# Altium project Servo-Board-v1.0.PrjPcb (part 8 of 19)

## Sheet Sec_Controller_Sheet2.SchDoc
size 420 x 297 mm; SheetNumber: 16; SheetTotal: 32
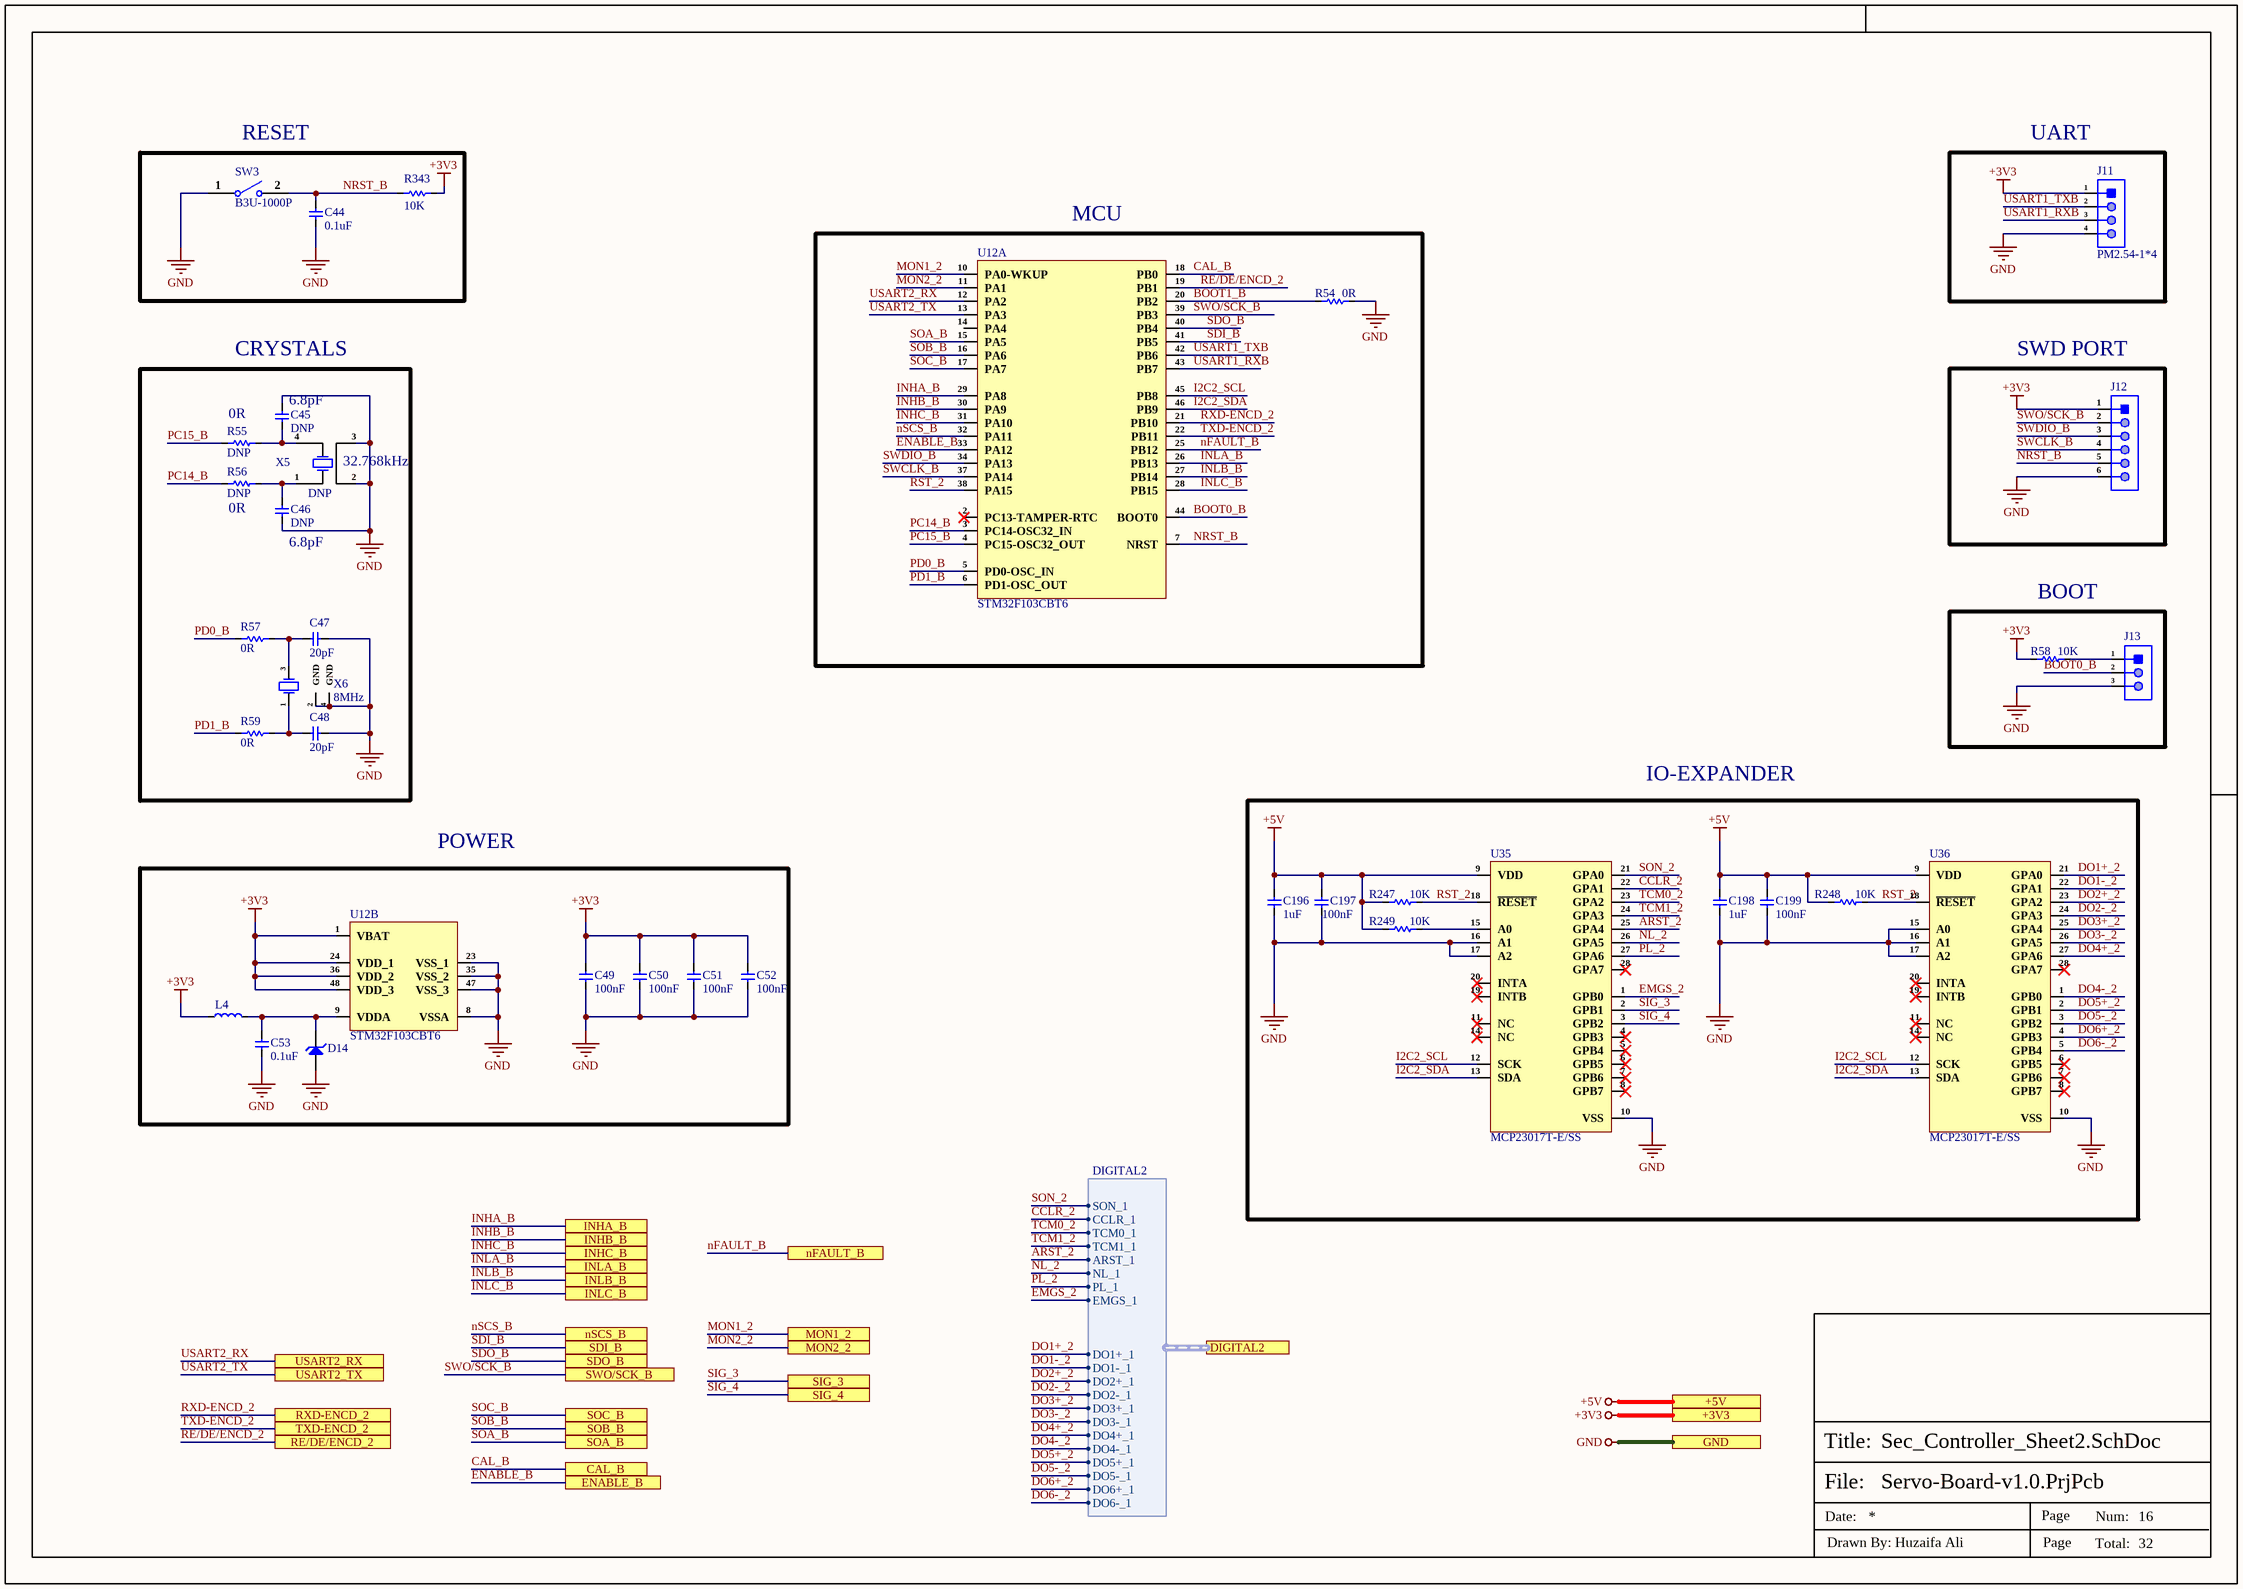
[diagram p15: Sec_Controller_Sheet2.SchDoc]

### Parts
C44  0.1uF  [Cap-0402]
C45  DNP  [Cap-0402]
C46  DNP  [Cap-0402]
C47  20pF  [Cap-0402]
C48  20pF  [Cap-0402]
C49  100nF  [cap-0402]
C50  100nF  [cap-0402]
C51  100nF  [cap-0402]
C52  100nF  [cap-0402]
C53  0.1uF  [Cap-0402]
C196  1uF  [Cap-0402]
C197  100nF  [cap-0402]
C198  1uF  [Cap-0402]
C199  100nF  [cap-0402]
D14  AZ3003-01G  [SOD-123]  (value not drawn)
J11  PM2.54-1*4  [HDR1X4 Female]
J12  X6511WV-06H-C60D30  [HDR1X6_]  (value not drawn)
J13  68000-103HLF  [HDR1X3_]  (value not drawn)
L4  BLM15AG601SN1D  [IND-0402]  (value not drawn)
R54  0R  [Res-0402]
R55  DNP  [Res-0603]
R56  DNP  [Res-0603]
R57  0R  [Res-0603]
R58  10K  [Res-0402]
R59  0R  [Res-0603]
R247  10K  [Res-0402]
R248  10K  [Res-0402]
R249  10K  [Res-0402]
R343  10K  [Res-0402]
SW3  B3U-1000P  [B3U-1000P]
U12  STM32F103CBT6  [48-LQFP (7x7)_]  (parts A,B of 2)
U35  MCP23017T-E/SS  [SSOP-28-208mil]
U36  MCP23017T-E/SS  [SSOP-28-208mil]
X5  DNP  [MC-306]
X6  8MHz  [5TJ480000XYLBC_]

### Blocks framed on the sheet
RESET: C44 R343 SW3
UART: J11
MCU: R54 U12
CRYSTALS: C45-C48 R55-R57 R59 X5 X6
SWD PORT: J12
BOOT: J13 R58
IO-EXPANDER: C196-C199 R247-R249 U35 U36
POWER: C49-C53 D14 L4 U12

### Ports
+3V3 (see Servo2[2A], CAN_Sheet[5D], Connector_Sheet[5D], Controller_Sheet[5D], Encoder_Sheet1[5D], Encoder_Sheet2[5D], Encoder_Sheet3[5D], Encoder_Sheet4[5D], EtherCAT_Sheet[5D], Motor_Driver_Sheet1[5D], Motor_Driver_Sheet2[5D], Motor_Driver_Sheet3[5D], Motor_Driver_Sheet4[5D], Power_Sheet[5D], RJ45_Sheet[5D], RS485_RS232_Sheet[3D], Sec_Controller_Sheet1[5D], Sec_Controller_Sheet3[5D], Sec_Controller_Sheet4[5D]), +5V, CAL_B (see Servo2[2B], Motor_Driver_Sheet2[3D]), DIGITAL2 (harness DIGITAL2, see Servo2[2B], DIO_2[4D]), ENABLE_B (see Servo2[2B], Motor_Driver_Sheet2[3D]), GND (see Servo2[2B], CAN_Sheet[5D], Connector_Sheet[5D], Controller_Sheet[5D], DIO_1[5D], DIO_2[5D], DIO_3[5D], DIO_4[5D], Encoder_Sheet1[5D], Encoder_Sheet2[5D], Encoder_Sheet3[5D], Encoder_Sheet4[5D], EtherCAT_Sheet[5D], MOSFET_Driver_Sheet1[5D], MOSFET_Driver_Sheet2[5D], MOSFET_Driver_Sheet3[5D], MOSFET_Driver_Sheet4[5D], Motor_Driver_Sheet1[5D], Motor_Driver_Sheet2[5D], Motor_Driver_Sheet3[5D], Motor_Driver_Sheet4[5D], Power_Sheet[5D], RJ45_Sheet[5D], RS485_RS232_Sheet[3D], Sec_Controller_Sheet1[5D], Sec_Controller_Sheet3[5D], Sec_Controller_Sheet4[5D]), INHA_B (see Servo2[2B], Motor_Driver_Sheet2[3D]), INHB_B (see Servo2[2B], Motor_Driver_Sheet2[3D]), INHC_B (see Servo2[2B], Motor_Driver_Sheet2[3D]), INLA_B (see Servo2[2B], Motor_Driver_Sheet2[3D]), INLB_B (see Servo2[2B], Motor_Driver_Sheet2[3D]), INLC_B (see Servo2[2B], Motor_Driver_Sheet2[3D]), MON1_2 (see Servo2[2B], DIO_2[3D]), MON2_2 (see Servo2[2B], DIO_2[3D]), nFAULT_B (see Servo2[2B], Motor_Driver_Sheet2[3D]), nSCS_B (see Servo2[2B], Motor_Driver_Sheet2[3D]), RE/DE/ENCD_2 (see Servo2[2B], Encoder_Sheet2[3D]), RXD-ENCD_2 (see Servo2[2B], Encoder_Sheet2[3D]), SDI_B (see Servo2[2B], Motor_Driver_Sheet2[3D]), SDO_B (see Servo2[2B], Motor_Driver_Sheet2[3D]), SIG_3 (see Servo2[2B], DIO_2[2D]), SIG_4 (see Servo2[2B], DIO_2[2D]), SOA_B (see Servo2[2B], Motor_Driver_Sheet2[3D]), SOB_B (see Servo2[2B], Motor_Driver_Sheet2[3D]), SOC_B (see Servo2[2B], Motor_Driver_Sheet2[3D]), SWO/SCK_B (see Servo2[2B], Motor_Driver_Sheet2[3D]), TXD-ENCD_2 (see Servo2[2B], Encoder_Sheet2[3D]), USART2_RX (see Servo2[2B], Controller_Sheet[2D], Servo2[1B]), USART2_TX (see Servo2[2B], Controller_Sheet[2D], Servo2[1B])

### Harnesses
DIGITAL2: SON_1, TCM0_1, CCLR_1, TCM1_1, ARST_1, NL_1, PL_1, EMGS_1, DO1+_1, DO1-_1, DO2+_1, DO2-_1, DO3+_1, DO3-_1, DO4+_1, DO4-_1, DO5+_1, DO5-_1, DO6+_1, DO6-_1

### Nets
+3V3: C49.2 C50.2 C51.2 C52.2 J11.1 J12.1 L4.1 R58.2 R343.2 U12.1(VBAT) U12.24(VDD_1) U12.36(VDD_2) U12.48(VDD_3) ; port +3V3
+5V: C196.2 C197.2 C198.2 C199.2 R247.2 R248.2 R249.2 U35.9(VDD) U36.9(VDD) ; port +5V
GND: C44.1 C45.2 C46.1 C47.2 C48.2 C49.1 C50.1 C51.1 C52.1 C53.1 C196.1 C197.1 C198.1 C199.1 D14.1(A) J11.4 J12.6 J13.3 R54.2 SW3.1 U12.8(VSSA) U12.23(VSS_1) U12.35(VSS_2) U12.47(VSS_3) U35.10(VSS) U35.16(A1) U35.17(A2) U36.10(VSS) U36.15(A0) U36.16(A1) U36.17(A2) X5.2 X5.3 X6.2(GND) X6.4(GND) ; port GND
ARST_2: U35.25(GPA4) ; port DIGITAL2.ARST_1
BOOT0_B: J13.2 U12.44(BOOT0)
BOOT1_B: R54.1 U12.20(PB2)
CAL_B: U12.18(PB0) ; port CAL_B
CCLR_2: U35.22(GPA1) ; port DIGITAL2.CCLR_1
DO1+_2: U36.21(GPA0) ; port DIGITAL2.DO1+_1
DO1-_2: U36.22(GPA1) ; port DIGITAL2.DO1-_1
DO2+_2: U36.23(GPA2) ; port DIGITAL2.DO2+_1
DO2-_2: U36.24(GPA3) ; port DIGITAL2.DO2-_1
DO3+_2: U36.25(GPA4) ; port DIGITAL2.DO3+_1
DO3-_2: U36.26(GPA5) ; port DIGITAL2.DO3-_1
DO4+_2: U36.27(GPA6) ; port DIGITAL2.DO4+_1
DO4-_2: U36.1(GPB0) ; port DIGITAL2.DO4-_1
DO5+_2: U36.2(GPB1) ; port DIGITAL2.DO5+_1
DO5-_2: U36.3(GPB2) ; port DIGITAL2.DO5-_1
DO6+_2: U36.4(GPB3) ; port DIGITAL2.DO6+_1
DO6-_2: U36.5(GPB4) ; port DIGITAL2.DO6-_1
EMGS_2: U35.1(GPB0) ; port DIGITAL2.EMGS_1
ENABLE_B: U12.33(PA12) ; port ENABLE_B
I2C2_SCL: U12.45(PB8) U35.12(SCK) U36.12(SCK)
I2C2_SDA: U12.46(PB9) U35.13(SDA) U36.13(SDA)
INHA_B: U12.29(PA8) ; port INHA_B
INHB_B: U12.30(PA9) ; port INHB_B
INHC_B: U12.31(PA10) ; port INHC_B
INLA_B: U12.26(PB13) ; port INLA_B
INLB_B: U12.27(PB14) ; port INLB_B
INLC_B: U12.28(PB15) ; port INLC_B
MON1_2: U12.10(PA0-WKUP) ; port MON1_2
MON2_2: U12.11(PA1) ; port MON2_2
nFAULT_B: U12.25(PB12) ; port nFAULT_B
NL_2: U35.26(GPA5) ; port DIGITAL2.NL_1
NRST_B: C44.2 J12.5 R343.1 SW3.2 U12.7(NRST)
nSCS_B: U12.32(PA11) ; port nSCS_B
PC14_B: R56.2 U12.3(PC14-OSC32_IN)
PC15_B: R55.2 U12.4(PC15-OSC32_OUT)
PD0_B: R57.2 U12.5(PD0-OSC_IN)
PD1_B: R59.2 U12.6(PD1-OSC_OUT)
PL_2: U35.27(GPA6) ; port DIGITAL2.PL_1
RE/DE/ENCD_2: U12.19(PB1) ; port RE/DE/ENCD_2
RST_2: R247.1 R248.1 U12.38(PA15) U35.18(~{RESET}) U36.18(~{RESET})
RXD-ENCD_2: U12.21(PB10) ; port RXD-ENCD_2
SDI_B: U12.41(PB5) ; port SDI_B
SDO_B: U12.40(PB4) ; port SDO_B
SIG_3: U35.2(GPB1) ; port SIG_3
SIG_4: U35.3(GPB2) ; port SIG_4
SOA_B: U12.15(PA5) ; port SOA_B
SOB_B: U12.16(PA6) ; port SOB_B
SOC_B: U12.17(PA7) ; port SOC_B
SON_2: U35.21(GPA0) ; port DIGITAL2.SON_1
SWCLK_B: J12.4 U12.37(PA14)
SWDIO_B: J12.3 U12.34(PA13)
SWO/SCK_B: J12.2 U12.39(PB3) ; port SWO/SCK_B
TCM0_2: U35.23(GPA2) ; port DIGITAL2.TCM0_1
TCM1_2: U35.24(GPA3) ; port DIGITAL2.TCM1_1
TXD-ENCD_2: U12.22(PB11) ; port TXD-ENCD_2
USART1_RXB: J11.3 U12.43(PB7)
USART1_TXB: J11.2 U12.42(PB6)
USART2_RX: U12.12(PA2) ; port USART2_RX
USART2_TX: U12.13(PA3) ; port USART2_TX
NetC45_1: C45.1 R55.1 X5.4(OSC2)
NetC46_2: C46.2 R56.1 X5.1(OSC1)
NetC47_1: C47.1 R57.1 X6.3(OSC2)
NetC48_1: C48.1 R59.1 X6.1(OSC1)
NetC53_2: C53.2 D14.2(K) L4.2 U12.9(VDDA)
NetJ13_1: J13.1 R58.1
NetR249_1: R249.1 U35.15(A0)

Not connected (* = marked no-connect by the designer): U12 2(PC13-TAMPER-RTC)* 14(PA4); U35 4(GPB3)* 5(GPB4)* 6(GPB5)* 7(GPB6)* 8(GPB7)* 11(NC)* 14(NC)* 19(INTB)* 20(INTA)* 28(GPA7)*; U36 6(GPB5)* 7(GPB6)* 8(GPB7)* 11(NC)* 14(NC)* 19(INTB)* 20(INTA)* 28(GPA7)*

### Notes on the sheet
- (near R55) 0R
- (near C45) 6.8pF
- (near R56) 0R
- (near X5) 32.768kHz
- (near C46) 6.8pF
- File:
- Title:
- Date:
- Page
- Num:
- Total:
- Drawn By: Huzaifa Ali

### Library data of the parts
C44 C53 = CC0402JRX7R7BB104: CAP CER 0.1UF 16V X7R 0402; Manufacturer: Yageo; Material: 4241ConductorMaterial; Value: 100nF; Tolerance: 5%; Item Type: Capacitor; Supplier: Digikey; Supplier Part Number: 311-1676-1-ND; Manufacturer Part Number: CC0402JRX7R7BB104; RoHS: Yes; Category: Ceramic Capacitors; Stock: 1659111; Pricing: 1=0.1, 10=0.046, 50=0.0262, 100=0.0203, 500=0.01528, 1000=0.012, 2500=0.01091, 5000=0.01004 (USD); Mounting Technology: Surface Mount; Case/Package: 0402; Case Code (Metric): 1005; Case Code (Imperial): 0402; Min Operating Temperature: -55°C; Max Operating Temperature: 125°C; Dielectric: X7R; Packaging: Tape and Reel; Package Quantity: 10000; Voltage Rating (DC): 16V; Voltage Rating: 16V; Series: CC; Construction: Flat; Length: 0.039inch; Width: 0.02inch; Height: 0.5mm; Thickness: 0.022inch; Lead Free: Lead Free; Halogen Free: Halogen Free; RoHS Compliant: Yes; ComponentLink1URL: https://datasheet.ciiva.com/13210/upy-gphc-x7r-6-3v-to-50v-8-12304-13210152.pdf?src-supplier=Mouser; ComponentLink1Description: https://datasheet.ciiva.com/13210/upy-gphc-x7r-6-3v-to-50v-8-12304-13210152.pdf?src-supplier=Mouser; LCSC Part Number: C541464
C45 C46 = CC0402CRNPO9BN6R8: CAP CER 6.8PF 50V C0G/NPO 0402; Manufacturer: Yageo; Dielectric: C0G; Tolerance: 2%; Insulation Resistance: 10GR; Item Type: Capacitor; Supplier: Future Electronics; Supplier Part Number: 3247368; Manufacturer Part Number: CC0402CRNPO9BN6R8; RoHS: Yes; Category: Ceramic Capacitors; Stock: 200000; Pricing: 10000=0.0024, 40000=0.0022, 150000=0.0021, 400000=0.002, 1000000=0.0019 (USD); Mounting Technology: Surface Mount; Case/Package: 0402; Case Code (Imperial): 0402; Case Code (Metric): 1005; Weight: 2.3E-05oz; Min Operating Temperature: -55°C; Max Operating Temperature: 125°C; Value: 6.8pF; Packaging: Tape and Reel; Voltage Rating: 50V; Voltage Rating (DC): 50V; Termination: SMD/SMT; Series: CC; Construction: Flat; Length: 1mm; Width: 0.5mm; Height: 0.5mm; Depth: 0.5mm; Radiation Hardening: No; RoHS Compliant: Yes; ComponentLink1URL: https://datasheet.ciiva.com/11587/upy-gp-np0-16v-to-50v-8-11587182.pdf?src-supplier=Avnet; ComponentLink1Description: https://datasheet.ciiva.com/11587/upy-gp-np0-16v-to-50v-8-11587182.pdf?src-supplier=Avnet; LCSC Part Number: C189470
C47 C48 = CC0402JRNPO9BN200: CAP CER 20PF 50V C0G/NPO 0402; Manufacturer: Yageo; Item Type: Capacitor; Temperature Coefficient: 30ppm/°C; Supplier: Avnet; LCSC Part Number: C107000; Manufacturer Part Number: CC0402JRNPO9BN200; RoHS: Yes; Stock: 20000; Pricing: 10000=0.00221 (USD); Halogen Free: 5694HalogenFree; ComponentLink1URL: https://datasheet.ciiva.com/176/mlccorderingcode-176360.pdf?src-supplier=Digikey; ComponentLink1Description: https://datasheet.ciiva.com/176/mlccorderingcode-176360.pdf?src-supplier=Digikey; ComponentLink2URL: https://datasheet.ciiva.com/176/mlccorderingcode-176361.pdf?src-supplier=Digikey; ComponentLink2Description: https://datasheet.ciiva.com/176/mlccorderingcode-176361.pdf?src-supplier=Digikey; ComponentLink3URL: https://datasheet.ciiva.com/176/mlccorderingcode-176362.pdf?src-supplier=Digikey; ComponentLink3Description: https://datasheet.ciiva.com/176/mlccorderingcode-176362.pdf?src-supplier=Digikey; ComponentLink4URL: https://datasheet.ciiva.com/7656/1132289-7656614.pdf?src-supplier=Element14; ComponentLink4Description: https://datasheet.ciiva.com/7656/1132289-7656614.pdf?src-supplier=Element14; ComponentLink5URL: https://datasheet.ciiva.com/5427/upy-gp-np0-16v-to-50v-8-3714-5427769.pdf?src-supplier=Mouser; ComponentLink5Description: https://datasheet.ciiva.com/5427/upy-gp-np0-16v-to-50v-8-3714-5427769.pdf?src-supplier=Mouser
C49-C52 C197 C199 = C1005X7R1H104KT000F: CAP CER 0.1UF 50V X7R 0402; Manufacturer: TDK; Tolerance: 10%; Voltage: 25V; Item Type: Capacitor; Supplier 1: Avnet; Manufacturer Part Number: C1005X7R1H104KT000F; RoHS: No; Category: Ceramic Capacitors; Dielectric: X7R; Supplier Part Number 1: C1005X7R1H104KT000F; LCSC Part Number: C361198; ComponentLink1Description: LCSC; ComponentLink1URL: https://www.lcsc.com/product-detail/Multilayer-Ceramic-Capacitors-MLCC-SMD-SMT_TDK-C1005X7R1H104KT000F_C361198.html
C196 C198 = CC0402KRX5R6BB105: CAP CER 1UF 10V X5R 0402; Manufacturer: Yageo; Tolerance: 10%; Dissipation Factor: 15%; Item Type: Capacitor; Supplier 1: Mouser; Manufacturer Part Number: CC0402KRX5R6BB105; RoHS: Yes; Category: Ceramic Capacitors; Stock 1: 6711367; Pricing 1: 1=0.11000, 10=0.05500, 50=0.05500, 100=0.03300, 500=0.02700, 1000=0.02200, 2500=0.02100, 10000=0.01800 (USD); Mount: Surface Mount; Case/Package: 0402; Number of Pins: 2; Case Code (Metric): 1005; Case Code (Imperial): 0402; Min Operating Temperature: -55°C; Max Operating Temperature: 85°C; Capacitance: 1uF; Dielectric: X5R; Package Quantity: 1; Voltage Rating: 10V; Packaging: Tape and Reel; Voltage Rating (DC): 10V; Termination: SMD/SMT; Resistor Type: Ceramic; Series: CC; Construction: Flat; Length: 1mm; Width: 0.02inch; Height: 0.5mm; Thickness: 0.022inch; Depth: 0.5mm; Radiation Hardening: No; REACH SVHC: No SVHC; Lead Free: Lead Free; Halogen Free: Halogen Free; RoHS Compliant: Yes; ComponentLink1URL: https://datasheet.ciiva.com/176/upy-gphc-x5r-4v-to-50v-12-176704.pdf?src-supplier=Digi-Key; ComponentLink1Description: https://datasheet.ciiva.com/176/upy-gphc-x5r-4v-to-50v-12-176704.pdf?src-supplier=Digi-Key; ComponentLink2URL: https://datasheet.ciiva.com/176/mlccorderingcode-176705.pdf?src-supplier=Digi-Key; ComponentLink2Description: https://datasheet.ciiva.com/176/mlccorderingcode-176705.pdf?src-supplier=Digi-Key; ComponentLink3URL: https://datasheet.ciiva.com/176/mlccorderingcode-176706.pdf?src-supplier=Digi-Key; ComponentLink3Description: https://datasheet.ciiva.com/176/mlccorderingcode-176706.pdf?src-supplier=Digi-Key; Supplier Part Number 1: 603-CC402KRX5R6BB105; LCSC Part Number: C106254
D14 = AZ3003-01G: TVS SURGE PROTECTOR 1-CH 3.3V; Manufacturer: Amazing; Item Type: Diode; Manufacturer Part Number: AZ3003-01G; Package: SOD-123; LCSC Part Number: -; ComponentLink1Description: Digikey; ComponentLink1URL: https://www.digikey.com/en/products/detail/amazing/AZ3003-01G/16615352?s=N4IgTCBcDaIIIC0DMAGFSC0KCMBxEAugL5A
J11 = PM2.54-1*4: 2mm 2.54mm Plugin 2.5A -40℃~+105℃ Straight 1x4P Top 8.5mm 4 Square Hole Plugin,P=2.54mm Female Headers ROHS; Manufacturer: ZHOURI; Manufacturer Part Number: PM2.54-1*4; Package: Plugin,P=2.54mm; LCSC Part Number: C5116530; Item Type: Female Header; ComponentLink1Description: LCSC; ComponentLink1URL: https://www.lcsc.com/product-detail/span-style-background-color-ff0-Female-span-Headers_ZHOURI-PM2-54-1-4_C5116530.html
J12 = X6511WV-06H-C60D30: Gold 250V 3A Straight Square Pins 2.5mm 6P 260℃ 6mm -40℃~+105℃ 3mm 2.54mm Plugin Black Brass 1x6P Plugin,P=2.54mm Pin Headers ROHS; Manufacturer: XKB; Item Type: Male Header; Manufacturer Part Number: X6511WV-06H-C60D30; Package: Plugin,P=2.54mm; LCSC Part Number: C706878; ComponentLink1Description: LCSC; ComponentLink1URL: https://www.lcsc.com/product-detail/Pin-Headers_XKB-Connectivity-X6511WV-06H-C60D30_C706878.html
J13 = 68000-103HLF: CONN HEADER VERT 3POS 2.54MM; Item Type: Male Header; Number of Positions: 3; Current Rating: 3A; Insulation Resistance: 5GR; Voltage Rating: 1.5kV; Contact Post Length: 2.41mm; LCSC Part Number: C168677; ComponentLink1Description: LCSC; Supplier: Avnet; Supplier Part Number: 88K1775; RoHS: No; Category: Headers and Wire Housings; Stock: 2805; Pricing: 1=0.395, 10=0.31, 25=0.29, 50=0.27, 100=0.25 (USD); Contact Plating: Gold,GXT; Contact Material: Bronze; Housing Material: Thermoplastic; Housing Color: Black; Min Operating Temperature: -65°C; Max Operating Temperature: 125°C; Number of Rows: 1; Termination: Through Hole; Packaging: Bulk; Number of Contacts: 3; Contact Gender: Male; Orientation: Straight; Max Voltage Rating (AC): 1.5kV; Package Quantity: 100; Series: 68000; Length: 7.62mm; Pitch: 2.54mm; Contact Mating Length: 5.84mm; Depth: 2.41mm; Radiation Hardening: No; Flammability Rating: UL94 V-0; Reach SVHC Compliant: No; ComponentLink2URL: https://datasheet.ciiva.com/46392/1914865-46392021.pdf?src-supplier=Element14; ComponentLink2Description: https://datasheet.ciiva.com/46392/1914865-46392021.pdf?src-supplier=Element14
L4 = BLM15AG601SN1D: FERRITE BEAD 600 OHM 0402 1LN; Manufacturer: Murata; Material: Steel,Ferrite; Impedance: 600R; Tolerance: 25%; Max DC Current: 300mA; DC Resistance (DCR): 520mR; Test Frequency: 100MHz; Number of Lines: 1; Shielding: Unshielded; DC Resistance-Max: 600mR; Supplier 1: Digi-Key; Manufacturer Part Number: BLM15AG601SN1D; RoHS: Yes; Category: Inductors; Stock 1: 4108655; Pricing 1: 1=0.10000, 10=0.06500, 25=0.05760, 50=0.05240, 100=0.04710, 250=0.03456, 500=0.02514, 1000=0.02461, 5000=0.01676 (USD); Case/Package: 0402; Number of Pins: 2; Core Material: Ferrite; Case Code (Metric): 1005; Case Code (Imperial): 0402; Min Operating Temperature: -55°C; Max Operating Temperature: 125°C; Package Quantity: 10000; Packaging: Tape and Reel; Current Rating: 300mA; Max Current Rating: 300mA; Termination: SMD/SMT; DC Current: 300mA; Frequency: 100MHz; Number of Circuits: 1; Series: BLM15AG_SN; Length: 1mm; Width: 0.5mm; Height: 0.5mm; Depth: 0.55mm; Radiation Hardening: No; REACH SVHC: No SVHC; Military Standard: Not; Lead Free: Lead Free; RoHS Compliant: Yes; ComponentLink1URL: https://datasheet.ciiva.com/11799/0900766b811b5866-11799226.pdf?src-supplier=RSComponents; ComponentLink1Description: https://datasheet.ciiva.com/11799/0900766b811b5866-11799226.pdf?src-supplier=RSComponents; ComponentLink2URL: https://datasheet.ciiva.com/41449/001172163-da-01-en-drossel-0402-600r-1-0x0-5mm-10000st-41449450.pdf?src-supplier=Conrad; ComponentLink2Description: https://datasheet.ciiva.com/41449/001172163-da-01-en-drossel-0402-600r-1-0x0-5mm-10000st-41449450.pdf?src-supplier=Conrad; ComponentLink3URL: https://datasheet.ciiva.com/29347/442210-da-01-en-chip-drossel-0402-600r-300ma-1-0x0-5mm-29347879.pdf?src-supplier=Conrad; ComponentLink3Description: https://datasheet.ciiva.com/29347/442210-da-01-en-chip-drossel-0402-600r-300ma-1-0x0-5mm-29347879.pdf?src-supplier=Conrad; ComponentLink4URL: https://datasheet.ciiva.com/1466/5144-1466744.pdf?src-supplier=Element14; ComponentLink4Description: https://datasheet.ciiva.com/1466/5144-1466744.pdf?src-supplier=Element14; ComponentLink5URL: https://datasheet.ciiva.com/1466/5144-1466745.pdf?src-supplier=Element14; ComponentLink5Description: https://datasheet.ciiva.com/1466/5144-1466745.pdf?src-supplier=Element14; ComponentLink6URL: https://datasheet.ciiva.com/14122/blm-series-eng-tds-14122894.pdf?src-supplier=Distrelec; ComponentLink6Description: https://datasheet.ciiva.com/14122/blm-series-eng-tds-14122894.pdf?src-supplier=Distrelec; ComponentLink7URL: https://datasheet.ciiva.com/6212/l0110s0100blm15ag-sn-6212519.pdf?src-supplier=Digi-Key; ComponentLink7Description: https://datasheet.ciiva.com/6212/l0110s0100blm15ag-sn-6212519.pdf?src-supplier=Digi-Key; ComponentLink8URL: https://datasheet.ciiva.com/6212/l0110s0100blm15ag-sn-6212565.pdf?src-supplier=Digi-Key; ComponentLink8Description: https://datasheet.ciiva.com/6212/l0110s0100blm15ag-sn-6212565.pdf?src-supplier=Digi-Key; ComponentLink9URL: https://datasheet.ciiva.com/6212/l0110s0100blm15ag-sn-6212520.pdf?src-supplier=Digi-Key; ComponentLink9Description: https://datasheet.ciiva.com/6212/l0110s0100blm15ag-sn-6212520.pdf?src-supplier=Digi-Key; ComponentLink10URL: https://datasheet.ciiva.com/8084/l0110s0100blm15ag-sn-8084271.pdf?src-supplier=Avnet; ComponentLink10Description: https://datasheet.ciiva.com/8084/l0110s0100blm15ag-sn-8084271.pdf?src-supplier=Avnet; ComponentLink11URL: https://datasheet.ciiva.com/8510/l0110s0100blm15ag-sn-8510909.pdf?src-supplier=Avnet; ComponentLink11Description: https://datasheet.ciiva.com/8510/l0110s0100blm15ag-sn-8510909.pdf?src-supplier=Avnet; Supplier Part Number 1: 490-1006-1-ND; LCSC Part Number: C76884; Item Type: Ferrite Bead
R54 = RC0402FR-070RL: RES 0 OHM JUMPER 1/16W 0402; Manufacturer: Yageo; Item Type: Resistors; Tolerance: 1%; Power Rating: 62.5mW; Voltage Rating: 50V; Temperature Coefficient: 200ppm/°C; Max Power Dissipation: 63mW; Supplier 1: Mouser; Manufacturer Part Number: RC0402FR-070RL; RoHS: Yes; Stock 1: 8556842; Pricing 1: 1=0.10000, 10=0.01400, 50=0.01400, 100=0.00600, 1000=0.00300, 5000=0.00200, 10000=0.00100 (USD); Mount: Surface Mount; Case/Package: 0402; Contact Plating: Tin,Matte; Case Code (Imperial): 0402; Case Code (Metric): 1005; Size Code: 0402; Min Operating Temperature: -55°C; Max Operating Temperature: 155°C; Resistance: 0R; Resistor Type: Thick Film; Packaging: Tape and Reel; Termination: SMD/SMT; Features: Moisture Resistant; Series: RC; Number of Terminations: 2; Length: 1mm; Width: 0.5mm; Height: 0.35mm; Radiation Hardening: No; Lead Free: Lead Free; RoHS Compliant: Yes; ComponentLink1URL: https://datasheet.ciiva.com/8896/pyu-rc0402-51-rohs-l-6-8896149.pdf?src-supplier=Avnet; ComponentLink1Description: https://datasheet.ciiva.com/8896/pyu-rc0402-51-rohs-l-6-8896149.pdf?src-supplier=Avnet; ComponentLink2URL: https://datasheet.ciiva.com/16790/pyu-rc0402-51-rohs-l-6-r-16790444.pdf?src-supplier=Future+Electronics; ComponentLink2Description: https://datasheet.ciiva.com/16790/pyu-rc0402-51-rohs-l-6-r-16790444.pdf?src-supplier=Future+Electronics; Supplier Part Number 1: 603-RC0402FR-070RL; LCSC Part Number: C106231
R55-R57 R59 = RC0603JR-070RL: RES 0 OHM JUMPER 1/10W 0603; Manufacturer: Yageo; Resistance: 0mR; Tolerance: 1%; Power Rating: 100mW; Voltage Rating (DC): 50V; Temperature Coefficient: 200ppm/°C; Resistance Tolerance: 5%; Item Type: Resistor; Supplier 1: Digi-Key; Manufacturer Part Number: RC0603JR-070RL; RoHS: Yes; Category: Chip SMD Resistors; Stock 1: 18081776; Pricing 1: 1=0.10000, 10=0.01700, 25=0.01240, 50=0.00960, 100=0.00700, 250=0.00536, 500=0.00430, 1000=0.00316 (USD); Case/Package: 0603; Number of Pins: 2; Contact Plating: Tin,Matte; Case Code (Imperial): 0603; Case Code (Metric): 1608; Size Code: 0603; Min Operating Temperature: -55°C; Max Operating Temperature: 155°C; Resistor Type: Thick Film; Packaging: Tape and Reel; Termination: SMD/SMT; Series: RC; Technology: THICK FILM; Package Quantity: 5000; Voltage Rating: 50V; Features: Moisture Resistant; Max Power Dissipation: 100mW; Number of Terminations: 2; Construction: Rectangular; Length: 1.6mm; Width: 0.8mm; Height: 0.45mm; Depth: 0.8mm; Radiation Hardening: No; Reach SVHC Compliant: No SVHC; Lead Free: Lead Free; RoHS Compliant: Yes; Military Standard: Not; Supplier Part Number 1: 311-0.0GRCT-ND; LCSC Part Number: C95177
R58 R247-R249 R343 = RC0402FR-0710KL: RES 10K OHM 1% 1/16W 0402; Manufacturer: Yageo; Resistance: 10kR; Voltage Rating (DC): 50V; Temperature Coefficient: 100ppm/°C; Power Rating: 62.5mW; Max Power Dissipation: 63mW; Item Type: Resistor; Supplier 1: Mouser; Manufacturer Part Number: RC0402FR-0710KL; RoHS: Yes; Category: Chip SMD Resistors; Stock 1: 18648329; Pricing 1: 1=0.10000, 10=0.01400, 50=0.01400, 100=0.00500, 1000=0.00300, 10000=0.00200 (USD); Case/Package: 0402; Number of Pins: 2; Case Code (Imperial): 0402; Case Code (Metric): 1005; Min Operating Temperature: -55°C; Max Operating Temperature: 155°C; Resistor Type: Thick Film; Tolerance: 1%; Packaging: Tape and Reel; Voltage Rating: 50V; Termination: SMD/SMT; Working Voltage: 50V; Number of Terminations: 2; Features: Moisture Resistant; Series: RC; Resistance Tolerance: 1%; Construction: Rectangular; Length: 1mm; Width: 0.5mm; Height: 0.32mm; Depth: 0.5mm; Lead Pitch: 0.2mm; REACH SVHC: No SVHC; Lead Free: Lead Free; RoHS Compliant: Yes; Military Standard: Not; ComponentLink1URL: https://datasheet.ciiva.com/7660/38568-7660787.pdf?src-supplier=Element14; ComponentLink1Description: https://datasheet.ciiva.com/7660/38568-7660787.pdf?src-supplier=Element14; ComponentLink2URL: https://datasheet.ciiva.com/7849/1686128-7849814.pdf?src-supplier=Element14; ComponentLink2Description: https://datasheet.ciiva.com/7849/1686128-7849814.pdf?src-supplier=Element14; ComponentLink3URL: https://datasheet.ciiva.com/7983/1018594-7983486.pdf?src-supplier=Element14; ComponentLink3Description: https://datasheet.ciiva.com/7983/1018594-7983486.pdf?src-supplier=Element14; ComponentLink4URL: https://datasheet.ciiva.com/22747/1018594-22747512.pdf?src-supplier=Element14; ComponentLink4Description: https://datasheet.ciiva.com/22747/1018594-22747512.pdf?src-supplier=Element14; ComponentLink5URL: https://datasheet.ciiva.com/12667/pyu-rc0402-51-rohs-l-6-r-12667067.pdf?src-supplier=Mouser; ComponentLink5Description: https://datasheet.ciiva.com/12667/pyu-rc0402-51-rohs-l-6-r-12667067.pdf?src-supplier=Mouser; ComponentLink6URL: https://datasheet.ciiva.com/7849/1784430-7849813.pdf?src-supplier=Element14; ComponentLink6Description: https://datasheet.ciiva.com/7849/1784430-7849813.pdf?src-supplier=Element14; ComponentLink7URL: https://datasheet.ciiva.com/7849/1784430-7849815.pdf?src-supplier=Element14; ComponentLink7Description: https://datasheet.ciiva.com/7849/1784430-7849815.pdf?src-supplier=Element14; Supplier Part Number 1: 603-RC0402FR-0710KL; LCSC Part Number: C60490
SW3 = B3U-1000P: SWITCH TACTILE SPST-NO 0.05A 12V; Manufacturer: Omron; Mechanical Life: 200000Cycles; Operating Force: 1.5N; Throw Configuration: SPST; Current Rating: 50mA; Contact Resistance: 100mR; Illumination Type: Non-Illuminated,Illuminated; Switch Travel: 0.15mm; Switch Function: Off-Mom; Actuator Type: Standard; Actuator Length: 0.4mm; Ratings: Dust Proof,IP40; ComponentLink1URL: http://www.farnell.com/datasheets/60838.pdf?src-supplier=Farnell; ComponentLink1Description: http://www.farnell.com/datasheets/60838.pdf?src-supplier=Farnell; ComponentLink2URL: http://www.farnell.com/datasheets/60838.pdf?src-supplier=Element14; ComponentLink2Description: http://www.farnell.com/datasheets/60838.pdf?src-supplier=Element14; ComponentLink3URL: https://omronfs.omron.com/en_US/ecb/products/pdf/en-b3u.pdf?src-supplier=Digi-Key; ComponentLink3Description: https://omronfs.omron.com/en_US/ecb/products/pdf/en-b3u.pdf?src-supplier=Digi-Key; ComponentLink4URL: http://www.omron.com/ecb/products/pdf/en-b3u.pdf?src-supplier=Digi-Key; ComponentLink4Description: http://www.omron.com/ecb/products/pdf/en-b3u.pdf?src-supplier=Digi-Key; ComponentLink5URL: https://www.distrelec.biz/Web/Downloads/he/et/B3U_eng_datasheet.pdf?mime=application%2Fpdf&src-supplier=Distrelec; ComponentLink5Description: https://www.distrelec.biz/Web/Downloads/he/et/B3U_eng_datasheet.pdf?mime=application%2Fpdf&src-supplier=Distrelec; ComponentLink6URL: http://www.onlinecomponents.com/productFiles/mf-OM/en-b3u.pdf?src-supplier=Onlinecomponents.com; ComponentLink6Description: http://www.onlinecomponents.com/productFiles/mf-OM/en-b3u.pdf?src-supplier=Onlinecomponents.com; Supplier 1: Digi-Key; Manufacturer Part Number: B3U-1000P; Stock 1: 116454; Pricing 1: 1=1, 10=0.961, 25=0.9064, 50=0.7976, 100=0.7251, 250=0.68888, 500=0.67074, 1000=0.52571 (USD); Mount: Surface Mount; Weight: 0.000776oz; Contact Material: Silver; Min Operating Temperature: -25°C; Max Operating Temperature: 70°C; Packaging: Tape and Reel; Voltage Rating (DC): 12V; Package Quantity: 1; Max Current Rating: 50mA; Termination: SMD/SMT; Orientation: Straight; Max Voltage Rating (DC): 12V; Electrical Life: 200000Cycles; Insulation Resistance: 100MR; Contact Current Rating: 50mA; Length: 4mm; Height: 1.2mm; Depth: 2.5mm; Width: 3mm; REACH SVHC: Unknown; Lead Free: Lead Free; ComponentLink7URL: https://www.verical.com/server-webapp/html/getDatasheet?partID=552554&src-supplier=Verical; ComponentLink7Description: https://www.verical.com/server-webapp/html/getDatasheet?partID=552554&src-supplier=Verical; ComponentLink8URL: http://www.farnell.com/datasheets/1685550.pdf?src-supplier=Element14; ComponentLink8Description: http://www.farnell.com/datasheets/1685550.pdf?src-supplier=Element14; ComponentLink9URL: http://www.farnell.com/datasheets/2610940.pdf?src-supplier=Farnell; ComponentLink9Description: http://www.farnell.com/datasheets/2610940.pdf?src-supplier=Farnell; ComponentLink10URL: https://www.alliedelec.com/m/d/4c8a9ef82804fc3c241a13c1e298fd73.pdf?src-supplier=Allied+Electronics; ComponentLink10Description: https://www.alliedelec.com/m/d/4c8a9ef82804fc3c241a13c1e298fd73.pdf?src-supplier=Allied+Electronics; Supplier Part Number 1: SW1020DKR-ND; LCSC Part Number: C231329; Item Type: Switch
U12 = STM32F103CBT6: IC MCU 32BIT 128KB FLASH 48LQFP; Manufacturer: STMicroelectronics; RAM Size: 20KB; Max Power Dissipation: 363mW; Interface: I2C,SPI,USB,CAN,IrDA,UART,USART,LIN; Number of I/Os: 37; Number of Timers/Counters: 4; Max Supply Voltage: 3.6V; Number of PWM Channels: 12; Frequency: 72MHz; Number of ADC Channels: 10; Min Supply Voltage: 2V; Oscillator Type: Internal; Data Bus Width: 32b; Number of Bits: 32; Number of SPI Channels: 2; Watchdog Timer: Yes; Peripherals: POR,PWM,WDT,DMA,Temp Sensor,I2C; Core Architecture: ARM; Supplier: Mouser; Supplier Part Number: 511-STM32F103CBT6; Manufacturer Part Number: STM32F103CBT6; RoHS: Yes; Category: Microcontrollers; Stock: 3552; Pricing: 1=7.35, 10=6.65, 50=5.53, 100=5.49, 1000=4.31, 10000=4.25 (USD); Case/Package: LQFP; Pins: 48; Min Operating Temperature: -40°C; Max Operating Temperature: 85°C; Package Quantity: 250; Density: 128KB; Packaging: Tray; Number of Programmable I/O: 37; Clock Frequency: 72MHz; Number of I2C Channels: 2; Memory Format: FLASH; Termination: SMD/SMT; Address Bus Width: 32b; Memory Size: 128KB; Series: STM32 F1; Length: 7mm; Width: 7.2mm; Height: 1.45mm; Radiation Hardening: No; Reach SVHC Compliant: No; Lead Free: Lead Free; RoHS Compliant: Yes; ComponentLink1URL: https://datasheet.ciiva.com/23669/1714663-23669200.pdf?src-supplier=Newark; ComponentLink1Description: https://datasheet.ciiva.com/23669/1714663-23669200.pdf?src-supplier=Newark; ComponentLink2URL: https://datasheet.ciiva.com/15122/getdatasheetpartid-92132-15122195.pdf?src-supplier=Verical; ComponentLink2Description: https://datasheet.ciiva.com/15122/getdatasheetpartid-92132-15122195.pdf?src-supplier=Verical; ComponentLink3URL: https://datasheet.ciiva.com/5752/cd00161566-5752838.pdf?src-supplier=Farnell; ComponentLink3Description: https://datasheet.ciiva.com/5752/cd00161566-5752838.pdf?src-supplier=Farnell; ComponentLink4URL: https://datasheet.ciiva.com/14100/pustm-arm-microcont-stm32f103-en-14100509.pdf?src-supplier=Distrelec; ComponentLink4Description: https://datasheet.ciiva.com/14100/pustm-arm-microcont-stm32f103-en-14100509.pdf?src-supplier=Distrelec; ComponentLink5URL: https://datasheet.ciiva.com/1502/cd00161566-1502328.pdf?src-supplier=Digi-Key; ComponentLink5Description: https://datasheet.ciiva.com/1502/cd00161566-1502328.pdf?src-supplier=Digi-Key; ComponentLink6URL: https://datasheet.ciiva.com/4840/cd00161566-4840398.pdf?src-supplier=Mouser; ComponentLink6Description: https://datasheet.ciiva.com/4840/cd00161566-4840398.pdf?src-supplier=Mouser; ComponentLink7URL: https://datasheet.ciiva.com/16219/cd00161566-16219150.pdf?src-supplier=Future+Electronics; ComponentLink7Description: https://datasheet.ciiva.com/16219/cd00161566-16219150.pdf?src-supplier=Future+Electronics; Item Type: IC; LCSC Part Number: C8304
U35 U36 = MCP23017T-E/SS: IC XPNDR 1.7MHZ I2C 28SSOP; Manufacturer: Microchip; Operating Supply Voltage: 5.5V; Interface: I2C,Serial; Number of Channels: 1; Output Current: 25mA; Number of I/Os: 16; Power Dissipation: 700mW; Clock Frequency: 10MHz; Output Type: PUSH-PULL; Supply Current: 1mA; Supplier 1: Digi-Key; Manufacturer Part Number: MCP23017T-E/SS; RoHS: Yes; Category: Interface ICs; Stock 1: 26314; Pricing 1: 1=1.69, 25=1.4, 100=1.28 (USD); Mounting Technology: Surface Mount; Case/Package: SSOP; Pins: 28; Min Operating Temperature: -40°C; Max Operating Temperature: 125°C; Package Quantity: 2100; Series: -; Packaging: Tape and Reel; Frequency: 1.7MHz; Number of Bits: 16; Nominal Supply Voltage: 5.5V; Lead Free: Lead Free; RoHS Compliant: Yes; ComponentLink1URL: https://datasheet.ciiva.com/12267/21952b-12267583.pdf?src-supplier=Mouser; ComponentLink1Description: https://datasheet.ciiva.com/12267/21952b-12267583.pdf?src-supplier=Mouser; ComponentLink2URL: https://datasheet.ciiva.com/8128/21952b-8128586.pdf?src-supplier=Avnet; ComponentLink2Description: https://datasheet.ciiva.com/8128/21952b-8128586.pdf?src-supplier=Avnet; ComponentLink3URL: https://datasheet.ciiva.com/16454/filehandler-aspxddocname-en023709-16454267.pdf?src-supplier=Future+Electronics; ComponentLink3Description: https://datasheet.ciiva.com/16454/filehandler-aspxddocname-en023709-16454267.pdf?src-supplier=Future+Electronics; ComponentLink4URL: https://datasheet.ciiva.com/1780/21952b-1780738.pdf?src-supplier=Digi-Key; ComponentLink4Description: https://datasheet.ciiva.com/1780/21952b-1780738.pdf?src-supplier=Digi-Key; Supplier Part Number 1: MCP23017T-E/SSCT-ND; LCSC Part Number: C558584; Item Type: IC
X5 = MC-306 32.7680K-A0:ROHS: 32.768kHz 12.5pF ±20ppm MC-306 Crystals ROHS; Manufacturer: Seiko Epson; Value: 32.786kHz; Manufacturer Part Number: MC-306 32.7680K-A0:ROHS; Item Type: Crystal; LCSC Part Number: C2650464; ComponentLink1Description: LCSC; ComponentLink1URL: https://www.lcsc.com/product-detail/Crystals_Seiko-Epson-MC-306-32-7680K-A0-ROHS_C2650464.html
X6 = 5TJ480000XYLBC: 8MHz 18pF ±10ppm SMD5032-4P Crystals ROHS; Manufacturer: JYJE; Manufacturer Part Number: 5TJ480000XYLBC; ComponentLink1Description: LCSC; ComponentLink1URL: https://www.lcsc.com/product-detail/Crystals_JYJE-5TJ480000XYLBC_C2149247.html; Package: SMD5032-4P; LCSC Part Number: C2149247; Item Type: Crystal

## Sheet MOSFET_Driver_Sheet2.SchDoc
size 420 x 297 mm; SheetNumber: 18; SheetTotal: 32
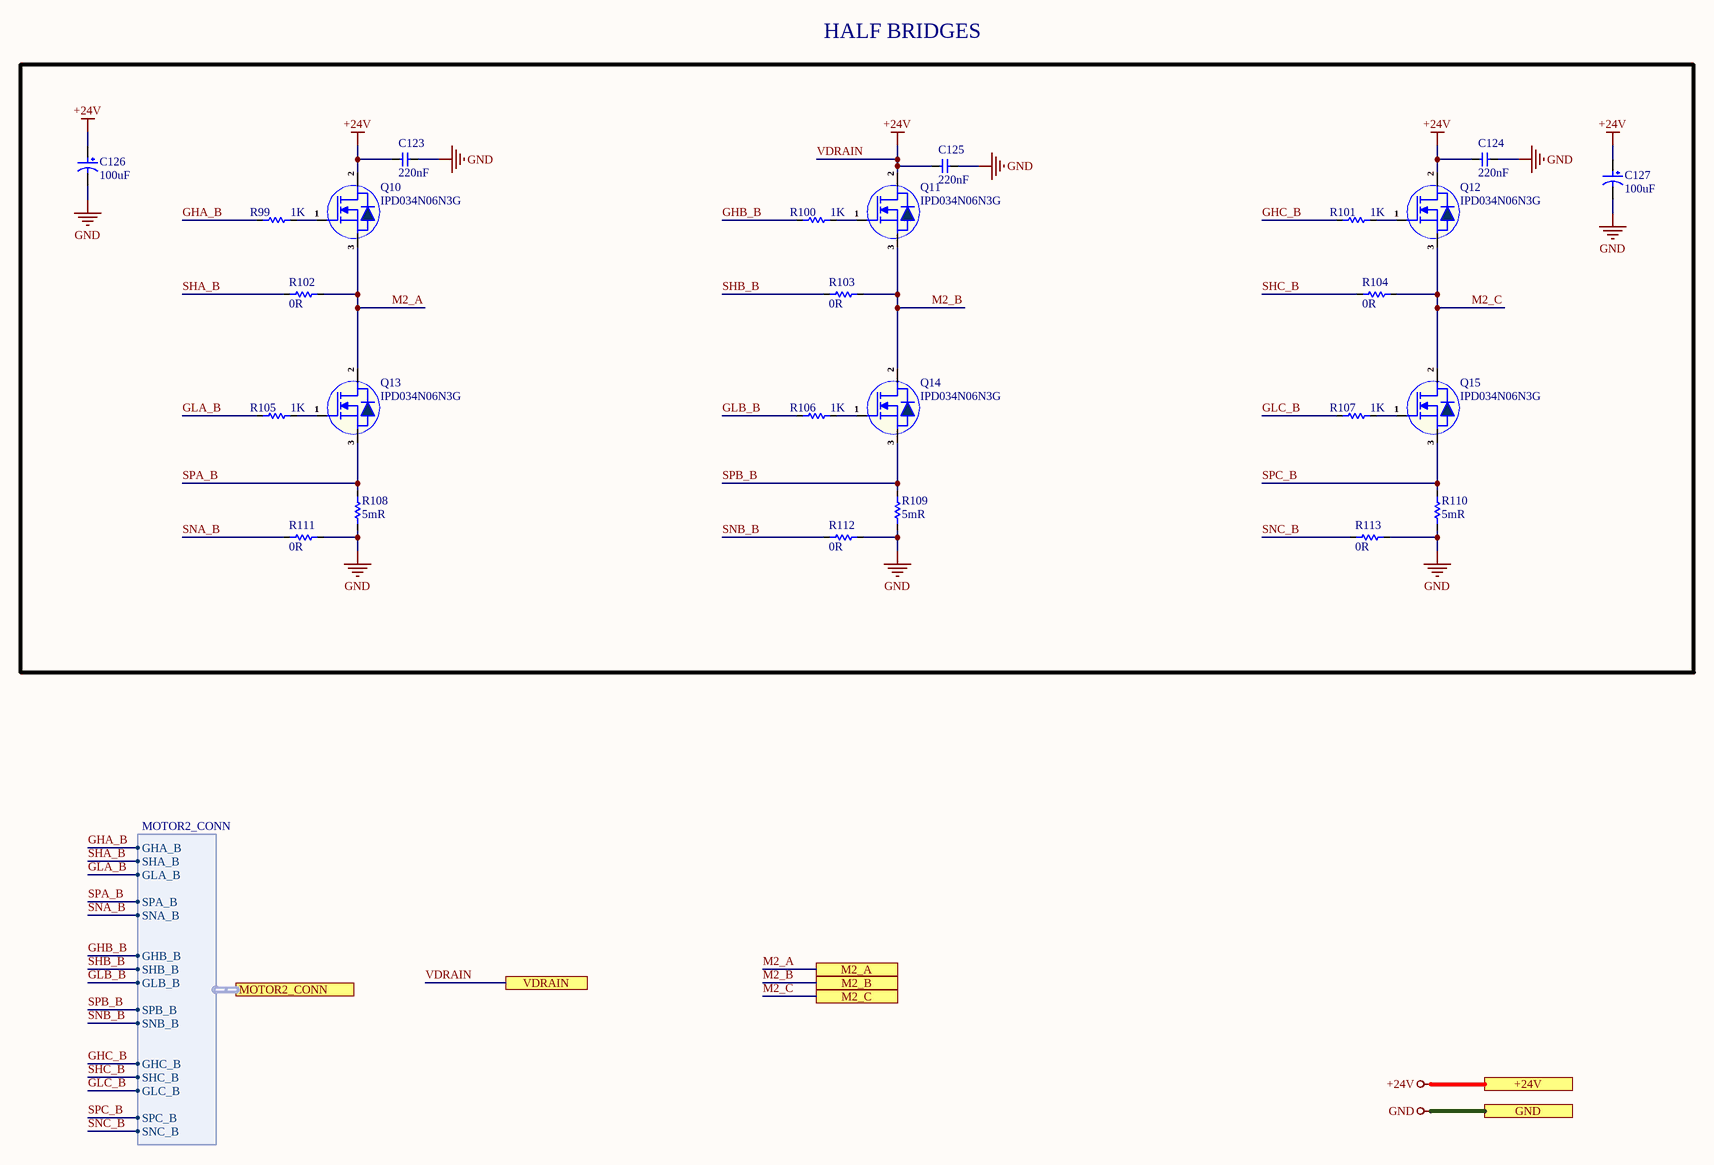
[diagram p16: MOSFET_Driver_Sheet2.SchDoc]

### Parts
C123  220nF  [Cap-0805]
C124  220nF  [Cap-0805]
C125  220nF  [Cap-0805]
C126  100uF  [RVT1A101M0605]
C127  100uF  [RVT1A101M0605]
Q10  IPD034N06N3G  [TO-252-2L]
Q11  IPD034N06N3G  [TO-252-2L]
Q12  IPD034N06N3G  [TO-252-2L]
Q13  IPD034N06N3G  [TO-252-2L]
Q14  IPD034N06N3G  [TO-252-2L]
Q15  IPD034N06N3G  [TO-252-2L]
R99  1K  [Res-0402]
R100  1K  [Res-0402]
R101  1K  [Res-0402]
R102  0R  [Res-0603]
R103  0R  [Res-0603]
R104  0R  [Res-0603]
R105  1K  [Res-0402]
R106  1K  [Res-0402]
R107  1K  [Res-0402]
R108  5mR  [Res-1206]
R109  5mR  [Res-1206]
R110  5mR  [Res-1206]
R111  0R  [Res-0603]
R112  0R  [Res-0603]
R113  0R  [Res-0603]

### Ports
+24V (see Servo2[4A], Connector_Sheet[5D], DIO_1[5D], DIO_2[5D], DIO_3[5D], DIO_4[5D], MOSFET_Driver_Sheet1[5D], MOSFET_Driver_Sheet3[5D], MOSFET_Driver_Sheet4[5D], Motor_Driver_Sheet1[5D], Motor_Driver_Sheet2[5D], Motor_Driver_Sheet3[5D], Motor_Driver_Sheet4[5D], Power_Sheet[5D]), GND (see Servo2[4B], CAN_Sheet[5D], Connector_Sheet[5D], Controller_Sheet[5D], DIO_1[5D], DIO_2[5D], DIO_3[5D], DIO_4[5D], Encoder_Sheet1[5D], Encoder_Sheet2[5D], Encoder_Sheet3[5D], Encoder_Sheet4[5D], EtherCAT_Sheet[5D], MOSFET_Driver_Sheet1[5D], MOSFET_Driver_Sheet3[5D], MOSFET_Driver_Sheet4[5D], Motor_Driver_Sheet1[5D], Motor_Driver_Sheet2[5D], Motor_Driver_Sheet3[5D], Motor_Driver_Sheet4[5D], Power_Sheet[5D], RJ45_Sheet[5D], RS485_RS232_Sheet[3D], Sec_Controller_Sheet1[5D], Sec_Controller_Sheet2[5D], Sec_Controller_Sheet3[5D], Sec_Controller_Sheet4[5D]), M2_A (see Servo2[5B], Connector_Sheet[4D], Servo2[5B]), M2_B (see Servo2[5B], Connector_Sheet[4D], Servo2[5B]), M2_C (see Servo2[5B], Connector_Sheet[4D], Servo2[5B]), MOTOR2_CONN (harness MOTOR2_CONN, see Servo2[4B], Motor_Driver_Sheet2[2D]), VDRAIN (see Servo2[4B], MOSFET_Driver_Sheet1[2D], MOSFET_Driver_Sheet3[2D], MOSFET_Driver_Sheet4[2D], Motor_Driver_Sheet1[2D], Motor_Driver_Sheet2[2D], Motor_Driver_Sheet3[2D], Motor_Driver_Sheet4[2D])

### Harnesses
MOTOR2_CONN: GHA_B, SHA_B, GLA_B, SPA_B, SNA_B, GHB_B, SHB_B, GLB_B, SPB_B, SNB_B, GHC_B, SHC_B, GLC_B, SPC_B, SNC_B

### Nets
GND: C123.1 C124.1 C125.1 C126.2 C127.2 R108.1 R109.1 R110.1 R111.1 R112.1 R113.1 ; port GND
VDRAIN: C123.2 C124.2 C125.2 C126.1 C127.1 Q10.2(D) Q11.2(D) Q12.2(D) ; port +24V, port VDRAIN  [also labelled +24V]
GHA_B: R99.1 ; port MOTOR2_CONN.GHA_B
GHB_B: R100.1 ; port MOTOR2_CONN.GHB_B
GHC_B: R101.1 ; port MOTOR2_CONN.GHC_B
GLA_B: R105.1 ; port MOTOR2_CONN.GLA_B
GLB_B: R106.1 ; port MOTOR2_CONN.GLB_B
GLC_B: R107.1 ; port MOTOR2_CONN.GLC_B
M2_A: Q10.3(S) Q13.2(D) R102.1 ; port M2_A
M2_B: Q11.3(S) Q14.2(D) R103.1 ; port M2_B
M2_C: Q12.3(S) Q15.2(D) R104.1 ; port M2_C
SHA_B: R102.2 ; port MOTOR2_CONN.SHA_B
SHB_B: R103.2 ; port MOTOR2_CONN.SHB_B
SHC_B: R104.2 ; port MOTOR2_CONN.SHC_B
SNA_B: R111.2 ; port MOTOR2_CONN.SNA_B
SNB_B: R112.2 ; port MOTOR2_CONN.SNB_B
SNC_B: R113.2 ; port MOTOR2_CONN.SNC_B
SPA_B: Q13.3(S) R108.2 ; port MOTOR2_CONN.SPA_B
SPB_B: Q14.3(S) R109.2 ; port MOTOR2_CONN.SPB_B
SPC_B: Q15.3(S) R110.2 ; port MOTOR2_CONN.SPC_B
NetQ10_1: Q10.1(G) R99.2
NetQ11_1: Q11.1(G) R100.2
NetQ12_1: Q12.1(G) R101.2
NetQ13_1: Q13.1(G) R105.2
NetQ14_1: Q14.1(G) R106.2
NetQ15_1: Q15.1(G) R107.2

### Notes on the sheet
- HALF BRIDGES
- File:
- Title:
- Date:
- Page
- Num:
- Total:
- Drawn By: Huzaifa Ali

### Library data of the parts
C123-C125 = 08051C224K4T2A: CAP CER 0.22UF 100V X7R 0805; Manufacturer: Kyocera AVX; Tolerance: 10%; Item Type: Capacitor; Supplier 1: Digi-Key; Manufacturer Part Number: 08051C224K4T2A; RoHS: Yes; Category: Ceramic Capacitors; Stock 1: 151; Pricing 1: 1=0.27000, 10=0.18500, 50=0.12320, 100=0.10470, 500=0.07392, 1000=0.06468 (USD); Mount: Surface Mount; Case/Package: 0805; Contact Plating: Tin; Min Operating Temperature: -55°C; Max Operating Temperature: 125°C; Termination: Wraparound; Capacitance: 220nF; Dielectric: X7R; Voltage Rating (DC): 100V; Length: 2.01mm; RoHS Compliant: Yes; ComponentLink1URL: http://datasheets.avx.com/AutoMLCC.pdf?src-supplier=Avnet+Asia; ComponentLink1Description: http://datasheets.avx.com/AutoMLCC.pdf?src-supplier=Avnet+Asia; Supplier Part Number 1: 478-13049-1-ND; LCSC Part Number: C2176107
C126 C127 = RVT1A101M0605: 100uF 10V 55mA@120Hz ±20% SMD,D6.3xL5.4mm Aluminum Electrolytic Capacitors - SMD ROHS; Manufacturer: ROQANG; Manufacturer Part Number: RVT1A101M0605; Package: SMD,D6.3xL5.4mm; LCSC Part Number: C72474; Item Type: Capacitor; ComponentLink1Description: LCSC; ComponentLink1URL: https://www.lcsc.com/product-detail/Aluminum-Electrolytic-Capacitors-SMD_ROQANG-RVT1A101M0605_C72474.html
Q10-Q15 = IPD034N06N3G: MOSFET N-CH 60V 100A TO252-3; Manufacturer: Infineon; Supplier: Mouser; Supplier Part Number: 726-IPD034N06N3G; Manufacturer Part Number: IPD034N06N3G; RoHS: Yes; Stock: 7587; Pricing: 1=1.76, 10=1.48, 50=1.48, 100=1.2, 1000=0.837, 10000=0.747 (USD); LCSC Part Number: C94897; Item Type: Mosfet
R99-R101 R105-R107 = RC0402FR-071KL: RES 1K OHM 1% 1/16W 0402; Manufacturer: Yageo; Resistance: 1kR; Temperature Coefficient: 100ppm/°C; Voltage Rating (DC): 50V; Power Rating: 62.5mW; Max Power Dissipation: 63mW; Item Type: Resistor; Supplier 1: Avnet; Manufacturer Part Number: RC0402FR-071KL; RoHS: Yes; Category: Chip SMD Resistors; Stock 1: 13030000; Pricing 1: 10000=0.00085, 20000=0.00087, 40000=0.00084, 60000=0.00083, 80000=0.00079, 100000=0.00078, 1000000=0.00076 (USD); Case/Package: 0402; Number of Pins: 2; Case Code (Imperial): 0402; Case Code (Metric): 1005; Size Code: 0402; Min Operating Temperature: -55°C; Max Operating Temperature: 155°C; Resistor Type: Thick Film; Tolerance: 1%; Packaging: Tape and Reel; Voltage Rating: 50V; Termination: SMD/SMT; Features: Moisture Resistant; Series: RC; Number of Terminations: 2; Resistance Tolerance: 1%; Construction: Rectangular; Technology: THICK FILM; Length: 1mm; Width: 0.5mm; Height: 0.32mm; Depth: 0.5mm; Reach SVHC Compliant: Yes; Lead Free: Lead Free; RoHS Compliant: Yes; Military Standard: Not; ComponentLink1URL: https://datasheet.ciiva.com/11819/0900766b80c66297-11819477.pdf?src-supplier=RSComponents; ComponentLink1Description: https://datasheet.ciiva.com/11819/0900766b80c66297-11819477.pdf?src-supplier=RSComponents; ComponentLink2URL: https://datasheet.ciiva.com/7983/1018594-7983502.pdf?src-supplier=Element14; ComponentLink2Description: https://datasheet.ciiva.com/7983/1018594-7983502.pdf?src-supplier=Element14; ComponentLink3URL: https://datasheet.ciiva.com/22747/1018594-22747513.pdf?src-supplier=Element14; ComponentLink3Description: https://datasheet.ciiva.com/22747/1018594-22747513.pdf?src-supplier=Element14; ComponentLink4URL: https://datasheet.ciiva.com/12666/pyu-rc0402-51-rohs-l-6-r-12666741.pdf?src-supplier=Mouser; ComponentLink4Description: https://datasheet.ciiva.com/12666/pyu-rc0402-51-rohs-l-6-r-12666741.pdf?src-supplier=Mouser; ComponentLink5URL: https://datasheet.ciiva.com/7849/1018594-7849869.pdf?src-supplier=Element14; ComponentLink5Description: https://datasheet.ciiva.com/7849/1018594-7849869.pdf?src-supplier=Element14; ComponentLink6URL: https://datasheet.ciiva.com/7849/1018594-7849871.pdf?src-supplier=Element14; ComponentLink6Description: https://datasheet.ciiva.com/7849/1018594-7849871.pdf?src-supplier=Element14; ComponentLink7URL: https://datasheet.ciiva.com/17063/pyu-rc0402-51-rohs-l-6-r-17063193.pdf?src-supplier=Future+Electronics; ComponentLink7Description: https://datasheet.ciiva.com/17063/pyu-rc0402-51-rohs-l-6-r-17063193.pdf?src-supplier=Future+Electronics; Supplier Part Number 1: RC0402FR-071KL; LCSC Part Number: C106235
R102-R104 R111-R113 = RC0603JR-070RL: as R55-R57 on sheet Sec_Controller_Sheet2; Supplier 1: Digi-Key; Manufacturer Part Number: RC0603JR-070RL; RoHS: Yes; Category: Chip SMD Resistors; Stock 1: 18081776; Pricing 1: 1=0.10000, 10=0.01700, 25=0.01240, 50=0.00960, 100=0.00700, 250=0.00536, 500=0.00430, 1000=0.00316 (USD); Case/Package: 0603; Number of Pins: 2; Contact Plating: Tin,Matte; Case Code (Imperial): 0603; Case Code (Metric): 1608; Size Code: 0603; Min Operating Temperature: -55°C; Max Operating Temperature: 155°C; Resistor Type: Thick Film; Packaging: Tape and Reel; Termination: SMD/SMT; Series: RC; Technology: THICK FILM; Package Quantity: 5000; Voltage Rating: 50V; Features: Moisture Resistant; Max Power Dissipation: 100mW; Number of Terminations: 2; Construction: Rectangular; Length: 1.6mm; Width: 0.8mm; Height: 0.45mm; Depth: 0.8mm; Radiation Hardening: No; Reach SVHC Compliant: No SVHC; Lead Free: Lead Free; RoHS Compliant: Yes; Military Standard: Not; Supplier Part Number 1: 311-0.0GRCT-ND; LCSC Part Number: C95177
R108-R110 = CUM1206-15FR005: 1W 5mΩ ±1% 1206 Current Sense Resistors/Shunt Resistors ROHS; Manufacturer: FORT; Item Type: Capacitor; Manufacturer Part Number: CUM1206-15FR005; Package: 1206; LCSC Part Number: C5185588; ComponentLink1Description: LCSC; ComponentLink1URL: https://www.lcsc.com/product-detail/Current-Sense-Resistors-Shunt-Resistors_FORT-CUM1206-15FR005_C5185588.html